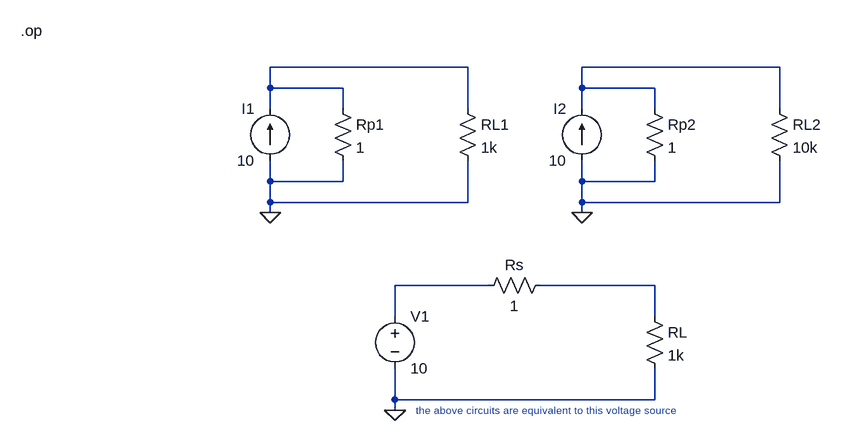
[diagram p0: schematic circuit.asc]
circuit.asc, the LTspice schematic file:
Version 4.1
SHEET 1 884 680
WIRE 320 32 16 32
WIRE 800 32 496 32
WIRE 16 64 16 32
WIRE 128 64 16 64
WIRE 496 64 496 32
WIRE 608 64 496 64
WIRE 16 96 16 64
WIRE 128 96 128 64
WIRE 320 96 320 32
WIRE 496 96 496 64
WIRE 608 96 608 64
WIRE 800 96 800 32
WIRE 16 208 16 176
WIRE 128 208 128 176
WIRE 128 208 16 208
WIRE 496 208 496 176
WIRE 608 208 608 176
WIRE 608 208 496 208
WIRE 16 240 16 208
WIRE 320 240 320 176
WIRE 320 240 16 240
WIRE 496 240 496 208
WIRE 800 240 800 176
WIRE 800 240 496 240
WIRE 16 256 16 240
WIRE 496 256 496 240
WIRE 352 368 208 368
WIRE 608 368 432 368
WIRE 208 416 208 368
WIRE 608 416 608 368
WIRE 208 544 208 496
WIRE 608 544 608 496
WIRE 608 544 208 544
WIRE 208 560 208 544
FLAG 16 256 0
FLAG 496 256 0
FLAG 208 560 0
DATAFLAG 304 32 ""
DATAFLAG 800 32 ""
DATAFLAG 592 368 ""
SYMBOL current 16 176 R180
WINDOW 0 24 80 Left 2
WINDOW 3 24 0 Left 2
WINDOW 123 0 0 Left 0
WINDOW 39 0 0 Left 0
SYMATTR InstName I1
SYMATTR Value 10
SYMBOL res 112 80 R0
SYMATTR InstName Rp1
SYMATTR Value 1
SYMBOL res 304 80 R0
SYMATTR InstName RL1
SYMATTR Value 1k
SYMBOL current 496 176 R180
WINDOW 0 24 80 Left 2
WINDOW 3 24 0 Left 2
WINDOW 123 0 0 Left 0
WINDOW 39 0 0 Left 0
SYMATTR InstName I2
SYMATTR Value 10
SYMBOL res 592 80 R0
SYMATTR InstName Rp2
SYMATTR Value 1
SYMBOL res 784 80 R0
SYMATTR InstName RL2
SYMATTR Value 10k
SYMBOL voltage 208 400 R0
WINDOW 123 0 0 Left 0
WINDOW 39 0 0 Left 0
SYMATTR InstName V1
SYMATTR Value 10
SYMBOL res 448 352 R90
WINDOW 0 0 56 VBottom 2
WINDOW 3 32 56 VTop 2
SYMATTR InstName Rs
SYMATTR Value 1
SYMBOL res 592 400 R0
SYMATTR InstName RL
SYMATTR Value 1k
TEXT -368 -24 Left 2 !.op
TEXT 240 560 Left 1 ;the above circuits are equivalent to this voltage source

The netlist it stands for:
* circuit.asc
I1 0 N001 10
Rp1 N001 0 1
RL1 N001 0 1k
I2 0 N002 10
Rp2 N002 0 1
RL2 N002 0 10k
V1 N003 0 10
Rs N004 N003 1
RL N004 0 1k
.op
* the above circuits are equivalent to this voltage source
.backanno
.end